# EasyEDA Pro project ProDoc_Relay_2025-09-14.epro, board PCB5
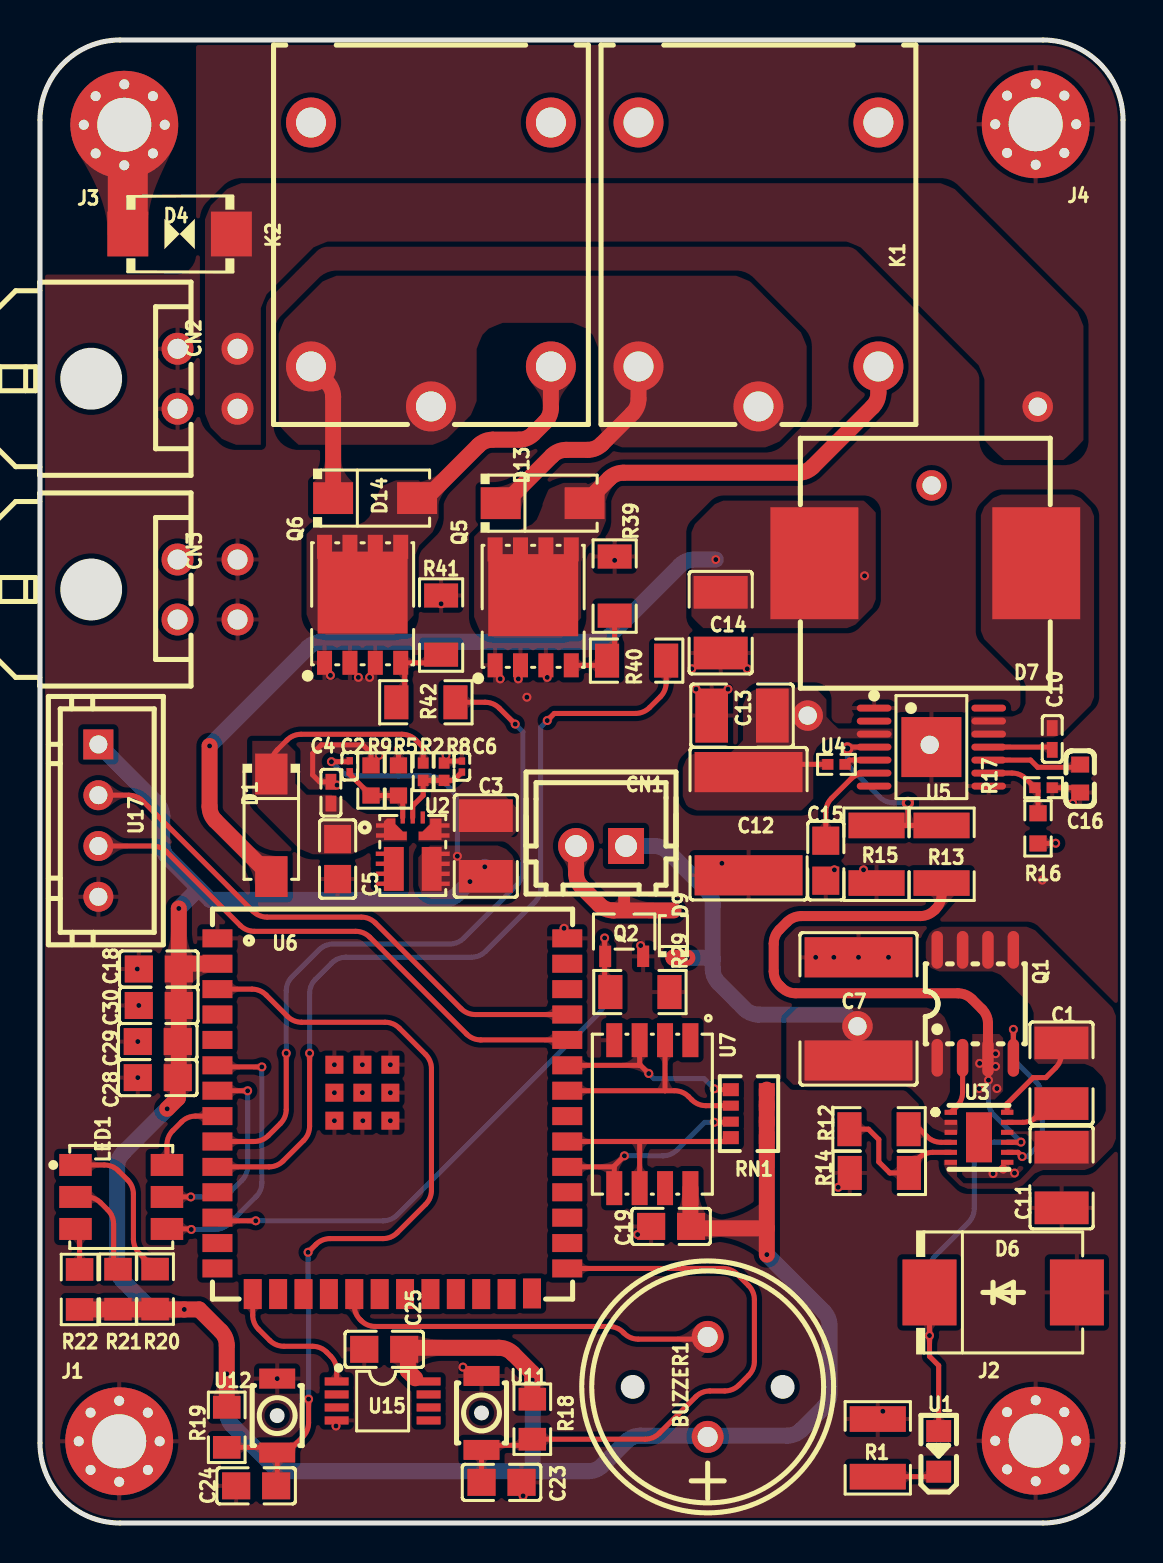
[diagram p1: board, top side]
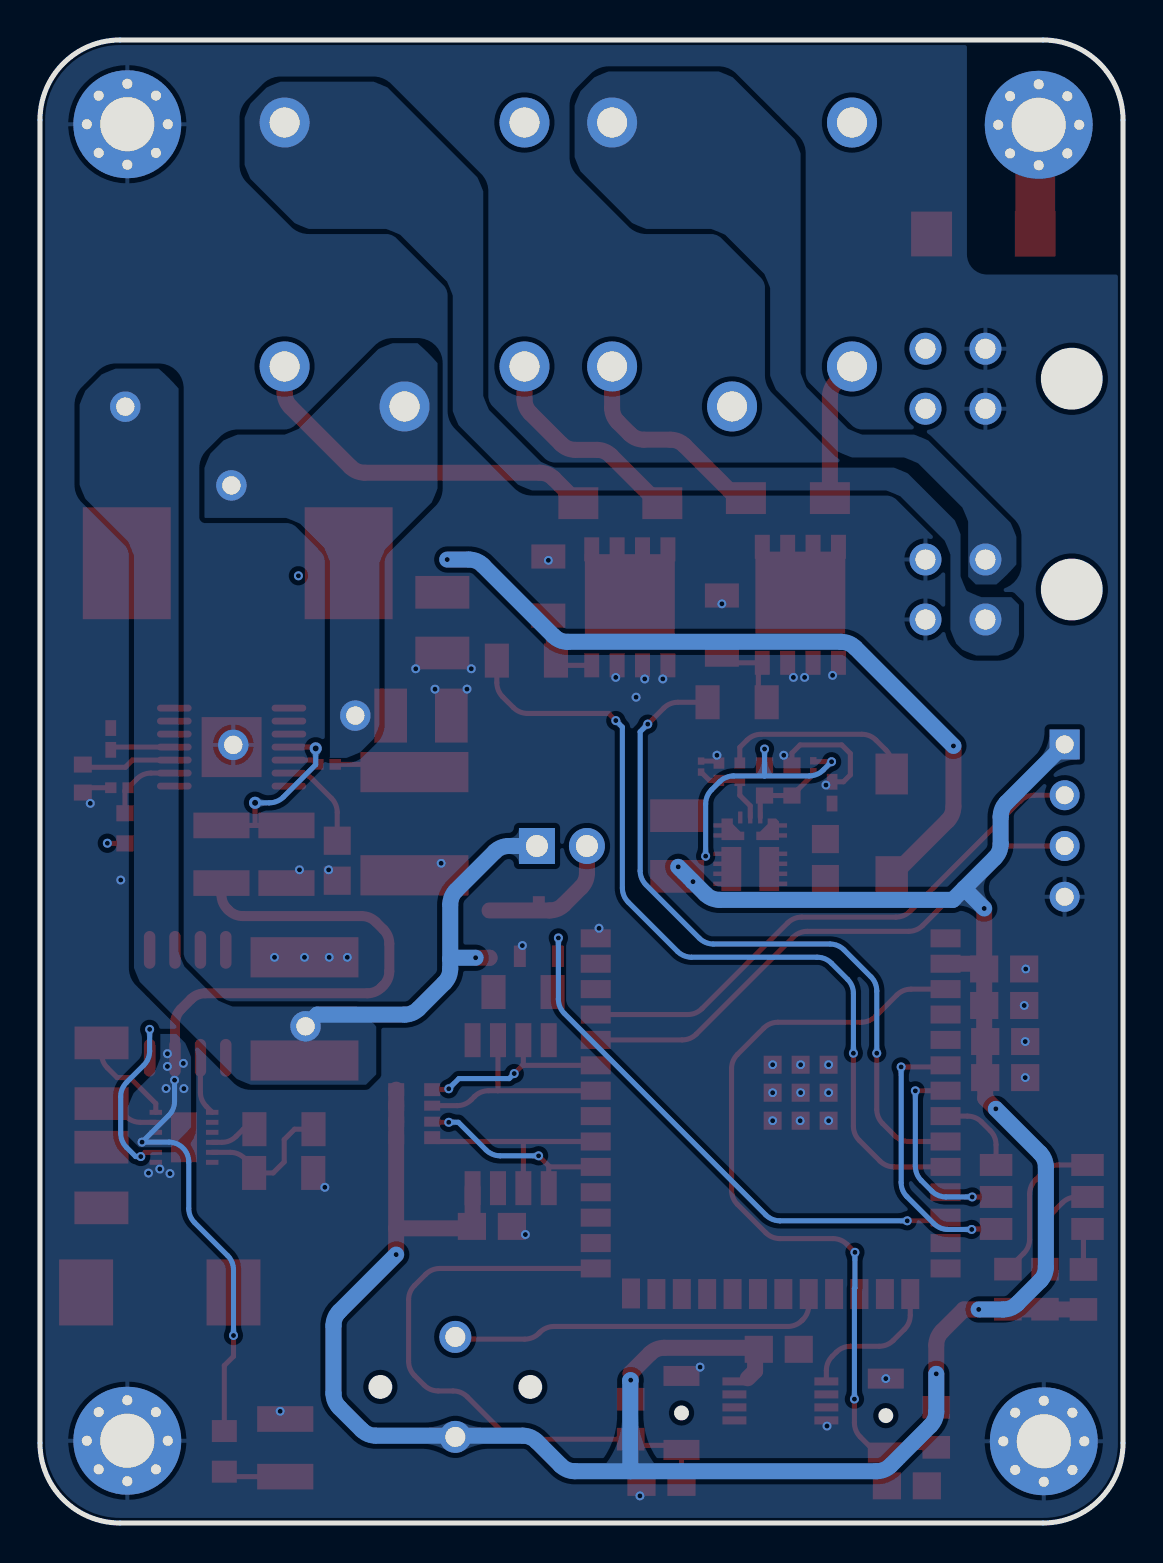
[diagram p2: board, bottom side, seen from below]

Outline 54.18 x 74.17 mm; copper layers: Top Layer, Inner1, Inner2, Bottom Layer. Coordinates in mm from the lower left corner of the outline.
Outline path: 0,70.17 0,4 arc(1.17,1.17) 4,0 50.18,0 arc(53.01,1.17) 54.18,4 54.18,70.17 arc(53.01,73) 50.18,74.17 4,74.17 arc(1.17,73) 0,70.17
Stack: Top Layer 0.035mm / Dielectric1 1.51mm FR4 er 4.5 / Inner1 0.035mm / Dielectric2 0.48mm PP er 4.5 / Inner2 0.035mm / Dielectric3 0.48mm PP er 4.5 / Bottom Layer 0.035mm

## Design rules (mm)
template: Custom Config
spacing copperThickness1oz (default): track to track 0.102, other pairs 0.152 to 0.3
spacing copperThickness2oz: track to track 0.203, other pairs 0.152 to 0.3
track width copperThickness1oz (default): min 0.127, default 0.254, max 2.54
track width copperThickness2oz: min 0.203, default 0.254, max 100
differential pair differentialPair (default): width min 0.127, default 0.254, max 2.54; gap min 0.152, default 0.152
via viaSize (default): diameter min 0.45, default 0.45, max 10; hole min 0.25, default 0.25, max 6.3

## Placement (name value [footprint] x y rotation side)
BUZZER1  4kHz  [BUZ-TH_PKM13EPYH4002-B0]  33.4 6.81 90 top
C1  100nF  [C1210]  51.1 22.49 270 top
C2  22pF  [C0201]  15.49 37.85 90 top
C3  47uF  [C1210]  22.3 33.86 270 top
C4  100nF  [C0402]  14.55 36.52 270 top
C5  10uF  [C0805]  14.89 33.21 90 top
C6  10nF  [C0201]  21.11 37.83 270 top
C7  1uF  [C2220]  40.95 25.71 90 top
C10  10nF  [C0402]  50.64 39.21 270 top
C11  100nF  [C1210]  51.11 17.28 90 top
C12  1uF  [C2220]  35.45 34.97 90 top
C13  100nF  [C1210]  35.12 40.38 0 top
C14  100uF  [C1210]  34.05 45.03 90 top
C15  22nF  [C0805]  39.31 33.12 90 top
C16  1uF  [C0603]  52.03 37.23 90 top
C18  100nF  [C0805]  5.94 27.71 0 top
C19  100nF  [C0805]  31.57 14.83 0 top
C23  100nF  [C0805]  23.09 2.03 0 top
C24  100nF  [C0805]  10.81 1.86 180 top
C25  100nF  [C0805]  17.22 8.69 0 top
C28  100nF  [C0805]  5.89 22.28 0 top
C29  100nF  [C0805]  5.89 24.08 0 top
C30  100nF  [C0805]  5.94 25.88 0 top
CN1  ZX-XH2.54-2PZZ  [CONN-TH_2P-P2.50_HX25003-2A]  28.07 33.86 180 top
CN2  430450400  [CONN-TH_0430450400]  8.38 57.23 270 top
CN3  430450400  [CONN-TH_0430450400]  8.38 46.69 270 top
D1  US1M  [SMA_L4.4-W2.8-LS5.4-RD]  11.57 34.89 270 top
D4  SMBJ58CA  [SMB_L4.6-W3.6-LS5.3-BI]  6.98 64.47 0 top
D6  SMCJ58A  [SMC_L6.9-W5.8-LS7.9-RD]  48.18 11.53 0 top
D7  68uH  [IND-SMD_L12.5-W12.5-SRR1280-150M]  44.29 48 180 top
D9  BAT46WJ,115  [SOD-323F_L2.0-W1.6-LS2.5-RD]  31.69 29.45 90 top
D13  1N4007  [SMA_L4.3-W2.5-LS5.0-RD]  25.15 51 0 top
D14  1N4007  [SMA_L4.3-W2.5-LS5.0-RD]  16.76 51.26 0 top
J1  SCREW-MOUNTING-HOLE-3MM  [MountingHole:MountingHole_2.7mm_M2.5_Pad_Via]  3.96 4.09 0 top
J2  SCREW-MOUNTING-HOLE-3MM  [MountingHole:MountingHole_2.7mm_M2.5_Pad_Via]  49.81 4.11 0 top
J3  SCREW-MOUNTING-HOLE-3MM  [MountingHole:MountingHole_2.7mm_M2.5_Pad_Via]  4.22 69.93 0 top
J4  SCREW-MOUNTING-HOLE-3MM  [MountingHole:MountingHole_2.7mm_M2.5_Pad_Via]  49.81 69.95 0 top
K1  SRD-48VDC-SL-C  [RELAY-TH_SRD-48VDC-SL-C]  35.94 62.94 90 top
K2  SRD-48VDC-SL-C  [RELAY-TH_SRD-48VDC-SL-C]  19.56 62.94 90 top
LED1  HL-AF-5060H271BU46FU79GC-S1-THL  [LED-ARRAY-SMD_6P-L5.4-W5.0-TL-FD]  4.06 16.31 0 top
NOREF  -  [Pad_e4917]  40.89 24.84 0 top
NOREF#2  -  [Pad_e5382]  44.6 51.89 0 top
NOREF#3  -  [Pad_e4911]  38.4 40.38 0 top
NOREF#4  -  [Pad_e4414]  44.51 38.92 0 top
NOREF#5  -  [Pad_e4914]  49.91 55.83 0 top
Q1  FDS3992  [SO-8_L4.9-W3.9-P1.27-LS5.9-BL]  46.79 25.97 0 top
Q2  AO3400A  [SOT-23-3_L2.9-W1.6-P1.90-LS2.8-BR]  29.22 29.58 270 top
Q5  SI7456  [POWERPAK-SO-8_L5.9-W4.9-P1.27-LS6.2-BL]  24.67 45.79 0 top
Q6  SI7456  [POWERPAK-SO-8_L5.9-W4.9-P1.27-LS6.2-BL]  16.14 45.92 0 top
R1  22kΩ  [R1210]  41.91 3.76 270 top
R2  22.1kΩ  [R0402]  19.17 37.57 90 top
R5  135kΩ  [R0603]  17.93 37.13 90 top
R8  10kΩ  [R0402]  20.22 37.57 270 top
R9  30kΩ  [R0603]  16.56 37.13 270 top
R12  105kΩ  [R1206]  41.97 19.69 0 top
R13  75kΩ  [R1210]  45.1 33.45 270 top
R14  2.21kΩ  [R1206]  41.99 17.51 0 top
R15  2.8kΩ  [R1210]  41.85 33.45 90 top
R16  3kΩ  [R0603]  49.93 34.74 270 top
R17  2kΩ  [R0402]  50.2 36.77 180 top
R18  10kΩ  [R0805]  24.63 5.19 270 top
R19  10kΩ  [R0805]  9.34 4.78 270 top
R20  300Ω  [R0805]  1.98 11.68 270 top
R21  300Ω  [R0805]  3.9 11.69 270 top
R22  300Ω  [R0805]  5.76 11.7 270 top
R29  68kΩ  [R1206]  30.01 26.55 0 top
R39  10MΩ  [R1206]  28.75 46.86 270 top
R40  10kΩ  [R1206]  29.84 43.13 0 top
R41  10MΩ  [R1206]  20.07 44.91 270 top
R42  10kΩ  [R1206]  19.3 41.05 0 top
RN1  10kΩ  [RES-ARRAY-SMD_0603-8P-L3.2-W1.6-BL]  35.46 20.47 270 top
U1  APT2012LZGCK  [LED-SMD_L2.0-W1.3-R-RD]  44.96 3.58 90 top
U2  TPSM863252RDXR  [QFN-7_L4.0-W3.3_TPSM863257RDXR]  18.65 34 0 top
U3  LM74800QDRRRQ1  [WSON-12_L3.0-W3.0-P0.50-TL-EP-2]  46.97 19.29 0 top
U4  261kΩ  [R0402]  39.84 37.94 180 top
U5  LM5161PWPR  [HTSSOP-14_L5.0-W4.4-P0.65-LS6.4-BL-EP3.0]  44.59 38.8 270 top
U6  ESP32-S3-WROOM-1U-N8R8  [WIRELM-SMD_ESP32-S3-WROOM-1U]  17.63 20.34 0 top
U7  MKDV8GIL-AST  [LGA-8_L6.0-W8.0-P1.27-TL]  30.63 20.45 270 top
U11  TD-1183SN-1.7H-250  [KEY-SMD_L3.0-W2.5-LS4.0]  22.09 5.5 90 top
U12  TD-1183SN-1.7H-250  [KEY-SMD_L3.0-W2.5-LS4.0]  11.87 5.37 90 top
U15  DS18B20U-MS  [MSOP-8_L3.0-W3.0-P0.65-LS4.9-BL-1]  17.14 6.11 270 top
U17  ZX-XH2.54-4PZZ-Y  [CONN-TH_4P-P2.50_ZX-XH2.54-4PZZ-Y]  2.92 35.13 90 top

## Footprints (pads in the part's own frame, mm; a bottom-side part is the same pattern mirrored in y, then rotated)
BUZ-TH_PKM13EPYH4002-B0
  round 1.6 hole 1: 1(-2.5,0) 2(2.5,0)
C0201
  rect 0.368x0.324 smd: 1(-0.275,0) 2(0.275,0)
C0402
  rect 0.79x0.54 smd: 1(-0.545,0) 2(0.545,0)
C0603
  rect 0.8x0.9 smd: 1(-0.7,0) 2(0.7,0)
C0805
  rect 1.41x1.35 smd: 1(-1,0) 2(1,0)
C1210
  rect 1.635x2.7 smd: 1(-1.518,0) 2(1.518,0)
C2220
  rect 2.01x5.4 smd: 1(-2.58,0) 2(2.58,0)
CONN-TH_2P-P2.50_HX25003-2A
  rect 1.8x1.8 hole 1.1: 1(-1.25,0)
  round 1.8 hole 1.1: 2(1.25,0)
CONN-TH_4P-P2.50_ZX-XH2.54-4PZZ-Y
  rect 1.5x1.5 hole 0.9: 1(3.81,0)
  round 1.5 hole 0.9: 2(1.27,0) 3(-1.27,0) 4(-3.81,0)
CONN-TH_0430450400
  round 1.6 hole 1: 1(1.5,-1.5) 2(-1.5,-1.5) 3(1.5,1.5) 4(-1.5,1.5)
HTSSOP-14_L5.0-W4.4-P0.65-LS6.4-BL-EP3.0
  oval 0.343x1.732 smd: 1(-1.95,-2.866) 2(-1.3,-2.866) 3(-0.65,-2.866) 4(0,-2.866) 5(0.65,-2.866) 6(1.3,-2.866) 7(1.95,-2.866) 8(1.95,2.866) 9(1.3,2.866) 10(0.65,2.866) 11(0,2.866) 12(-0.65,2.866) 13(-1.3,2.866) 14(-1.95,2.866)
  rect 3x3 smd: 15(0,0)
IND-SMD_L12.5-W12.5-SRR1280-150M
  rect 4.4x5.6 smd: 1(-5.55,0) 2(5.55,0)
KEY-SMD_L3.0-W2.5-LS4.0
  rect 1x1.8 smd: 1(-1.85,0) 2(1.85,0)
LED-ARRAY-SMD_6P-L5.4-W5.0-TL-FD
  rect 1.625x1.1 smd: 1(-2.288,1.6) 2(-2.288,0) 3(-2.288,-1.6) 4(2.288,-1.6) 5(2.288,0) 6(2.288,1.6)
LED-SMD_L2.0-W1.3-R-RD
  rect 1.1x1.25 smd: 1(1.016,0) 2(-1.016,0)
LGA-8_L6.0-W8.0-P1.27-TL
  rect 1.7x0.8 smd: 1(-3.7,1.905) 2(-3.7,0.635) 3(-3.7,-0.635) 4(-3.7,-1.905) 5(3.7,-1.905) 6(3.7,-0.635) 7(3.7,0.635) 8(3.7,1.905)
MountingHole:MountingHole_2.7mm_M2.5_Pad_Via
  round 0.8 hole 0.5: 1(-2.025,0) 1(-1.432,1.432) 1(-1.432,-1.432) 1(0,2.025) 1(0,-2.025) 1(1.432,1.432) 1(1.432,-1.432) 1(2.025,0)
  round 5.4 hole 2.7: 1(0,0)
MSOP-8_L3.0-W3.0-P0.65-LS4.9-BL-1
  rect 0.406x1.2 smd: 1(-0.975,-2.3) 2(-0.325,-2.3) 3(0.325,-2.3) 4(0.975,-2.3) 5(0.975,2.3) 6(0.325,2.3) 7(-0.325,2.3) 8(-0.975,2.3)
Pad_e4414
  round 1.524 hole 0.914: 1(0,0)
Pad_e4911
  round 1.524 hole 0.914: 1(0,0)
Pad_e4914
  round 1.524 hole 0.914: 1(0,0)
Pad_e4917
  round 1.524 hole 0.914: 1(0,0)
Pad_e5382
  round 1.524 hole 0.914: 1(0,0)
POWERPAK-SO-8_L5.9-W4.9-P1.27-LS6.2-BL
  rect 0.75x1.2 smd: 1(-1.905,-2.9) 2(-0.635,-2.9) 3(0.635,-2.9) 4(1.905,-2.9) 5(1.905,2.9) 6(0.635,2.9) 7(-0.635,2.9) 8(-1.905,2.9)
  rect 4.5x4.1 smd: 8(0,0.609)
QFN-7_L4.0-W3.3_TPSM863257RDXR
  custom 1.54x1.08 smd: 1(-0.975,0.697) 4(0.975,0.697)
  custom 1.4x2.195 smd: 2(-1.05,-1.286) 3(1.05,-1.286)
  rect 0.22x0.6 smd: 5(0.5,1.286) 6(0,1.286) 7(-0.5,1.286)
R0402
  rect 0.566x0.54 smd: 1(-0.433,0) 2(0.433,0)
R0603
  rect 0.806x0.864 smd: 1(-0.753,0) 2(0.753,0)
R0805
  rect 1.133x1.377 smd: 1(-1,0) 2(1,0)
R1206
  rect 1.208x1.701 smd: 1(-1.479,0) 2(1.479,0)
R1210
  rect 1.282x2.808 smd: 1(-1.441,0) 2(1.441,0)
RELAY-TH_SRD-48VDC-SL-C
  round 2.5 hole 1.5: 1(-5.1,-6) 2(-7.1,0) 3(7.1,-6) 4(7.1,6) 5(-5.1,6)
RES-ARRAY-SMD_0603-8P-L3.2-W1.6-BL
  rect 0.65x0.8 smd: 1(-1.2,-0.9) 4(1.2,-0.9) 5(1.2,0.9) 8(-1.2,0.9)
  rect 0.5x0.8 smd: 2(-0.4,-0.9) 3(0.4,-0.9) 6(0.4,0.9) 7(-0.4,0.9)
SMA_L4.3-W2.5-LS5.0-RD
  rect 2x1.593 smd: 1(-2.1,0) 2(2.1,0)
SMA_L4.4-W2.8-LS5.4-RD
  rect 2.046x1.62 smd: 1(-2.566,0) 2(2.566,0)
SMB_L4.6-W3.6-LS5.3-BI
  rect 2.047x2.241 smd: 1(-2.591,0) 2(2.591,0)
SMC_L6.9-W5.8-LS7.9-RD
  rect 2.7x3.3 smd: 1(-3.687,0) 2(3.687,0)
SO-8_L4.9-W3.9-P1.27-LS5.9-BL
  oval 0.574x1.888 smd: 1(-1.905,-2.699) 2(-0.635,-2.699) 3(0.635,-2.699) 4(1.905,-2.699) 5(1.905,2.699) 6(0.635,2.699) 7(-0.635,2.699) 8(-1.905,2.699)
SOD-323F_L2.0-W1.6-LS2.5-RD
  rect 0.73x0.385 smd: 1(-1.185,0) 2(1.185,0)
SOT-23-3_L2.9-W1.6-P1.90-LS2.8-BR
  rect 1.07x0.6 smd: 1(1.235,-0.95) 2(1.235,0.95) 3(-1.235,0)
WIRELM-SMD_ESP32-S3-WROOM-1U
  rect 1.5x0.9 smd: 1(-8.75,8.895) 2(-8.75,7.625) 3(-8.75,6.355) 4(-8.75,5.085) 5(-8.75,3.815) 6(-8.75,2.545) 7(-8.75,1.275) 8(-8.75,0.005) 9(-8.75,-1.265) 10(-8.75,-2.535) 11(-8.75,-3.805) 12(-8.75,-5.075) 13(-8.75,-6.345) 14(-8.75,-7.615) 27(8.75,-7.615) 28(8.75,-6.345) 29(8.75,-5.075) 30(8.75,-3.805) 31(8.75,-2.535) 32(8.75,-1.265) 33(8.75,0.005) 34(8.75,1.275) 35(8.75,2.545) 36(8.75,3.815) 37(8.75,5.085) 38(8.75,6.355) 39(8.75,7.625) 40(8.75,8.895)
  rect 0.9x1.5 smd: 15(-6.985,-8.895) 16(-5.715,-8.895) 17(-4.445,-8.895) 18(-3.175,-8.895) 19(-1.905,-8.895) 20(-0.635,-8.895) 21(0.635,-8.895) 22(1.905,-8.895) 23(3.175,-8.895) 24(4.445,-8.895) 25(5.715,-8.895) 26(6.985,-8.865)
  rect 0.9x0.9 smd: 41(-2.9,2.575) 41(-2.9,1.175) 41(-2.9,-0.225) 41(-1.5,2.575) 41(-1.5,1.175) 41(-1.5,-0.225) 41(-0.1,2.575) 41(-0.1,1.175) 41(-0.1,-0.225)
WSON-12_L3.0-W3.0-P0.50-TL-EP-2
  rect 0.623x0.25 smd: 1(-1.411,1.25) 2(-1.411,0.75) 3(-1.411,0.25) 4(-1.411,-0.25) 5(-1.411,-0.75) 6(-1.411,-1.25) 7(1.411,-1.25) 8(1.411,-0.75) 9(1.411,-0.25) 10(1.411,0.25) 11(1.411,0.75) 12(1.411,1.25)
  rect 1.3x2.5 smd: 13(0,0)

## Nets
As in the schematic, except:
+48V: C12.2 C13.2 D6.1 D13.1 D14.1 K1.2 K1.5 K2.2 K2.5 NOREF#2.1 NOREF#3.1 Q1.3 R13.2 U1.1 U3.9 U4.2 U5.3
GND: C3.1 C4.1 C5.1 C6.1 C7.2 C11.1 C12.1 C13.1 C14.1 C15.1 C16.1 C18.1 C19.1 C23.2 C24.2 C25.1 C28.1 C29.1 C30.1 CN2.1 CN2.2 CN3.3 CN3.4 D6.2 J1.1 J2.1 J4.1 NOREF#4.1 Q2.2 Q5.1 Q5.2 Q5.3 Q6.1 Q6.2 Q6.3 R1.1 R8.1 R9.1 R14.1 R15.1 R17.1 R29.2 R39.1 R41.1 U2.4 U3.7 U5.1 U5.2 U5.8 U5.15 U6.1 U6.40 U6.41 U7.4 U11.2 U12.2 U15.4 U17.4
VIN: C7.1 CN1.1 CN2.3 CN2.4 D4.2 D9.1 NOREF.1 NOREF#5.1 Q1.1 U3.2 U3.3

Pads without a net: K1 4; K2 4; U2 2 5; U3 13; U5 7 14; U6 11 13 14 16 17 18 20 21 22 23 24 25 26 28 29 30 33 38 39; U15 2 3 5 6 7

## Via types
v1: diameter 0.45, hole 0.25, Top Layer to Bottom Layer, 92 vias
v2: diameter 0.61, hole 0.305, Top Layer to Bottom Layer, 2 vias

## Routing (per net, layer and track width the routed paths; a pad name or vN(x,y) marks a point on that pad's centre or on a via; arc(x,y) is an arc through that point)
+3V3: length 147.2
  Top Layer w0.254: R5.2 v1(17.93,38.71) ; v1(14.58,38.07) 15.45,38.07 C2.2
  Top Layer w0.8: 36.36,14.74 v1(36.36,13.42) ; 36.36,14.74 32.71,14.74 32.54,14.91 U7.8 ; 36.36,14.74 36.36,19.39 ; R20.2 v1(7.22,10.68) 7.96,10.68 9.05,9.59 arc(9.27,9.27) 9.34,8.89 v1(9.34,7.46) R19.1 ; U6.2 7.21,27.97 C18.2 ; v1(6.36,20.71) 6.89,21.24 C28.2 6.94,22.33 C18.2 ; C18.2 v1(6.94,30.73) ; RN1.8 RN1.7 RN1.6 36.36,19.66 ; 18.77,7.24 18.4,7.6 18.4,8.76 22.95,8.76 arc(23.34,8.69) 23.66,8.47 24.63,7.5 v1(24.63,7.15) R18.1
  Bottom Layer w0.254: 17.93,37.36 19.47,37.36 arc(19.86,37.29) 20.18,37.07 20.59,36.67 arc(20.8,36.34) 20.88,35.96 v1(20.88,33.35) ; 17.93,37.36 15.7,37.36 arc(15.32,37.44) 15,37.66 v1(14.58,38.07) ; 17.93,37.36 v1(17.93,38.71)
  Bottom Layer w0.8: v1(24.63,7.15) 24.65,7.12 24.65,2.59 ; 24.65,2.59 12.33,2.59 arc(11.94,2.67) 11.62,2.88 9.64,4.87 arc(9.42,5.19) 9.34,5.57 v1(9.34,7.46) ; 24.65,2.59 27.42,2.59 arc(27.81,2.67) 28.13,2.88 29.32,4.08 arc(29.65,4.29) 30.03,4.37 33.34,4.37 ; v1(36.36,13.42) 39.2,10.58 arc(39.42,10.26) 39.5,9.87 39.5,6.48 arc(39.42,6.1) 39.2,5.78 38.09,4.66 arc(37.76,4.44) 37.38,4.37 33.34,4.37 ; v1(6.94,30.73) 7.94,31.73 ; 7.94,31.73 8.51,31.17 20.19,31.17 arc(20.57,31.24) 20.89,31.46 v1(21.51,32.08) v1(22.25,32.82) ; 7.94,31.73 6.41,33.26 arc(6.2,33.58) 6.12,33.97 6.12,35.32 arc(6.05,35.71) 5.83,36.03 U17.1 ; 33.34,4.37 BUZZER1.1 ; v1(6.36,20.71) 4.15,18.5 arc(3.94,18.18) 3.86,17.8 3.86,12.81 arc(3.94,12.43) 4.15,12.1 5.28,10.97 arc(5.61,10.76) 5.99,10.68 v1(7.22,10.68)
+5V: length 57
  Top Layer w0.254: R16.2 50.8,33.99 v1(50.81,34)
  Top Layer w0.8: D1.2 8.78,35.12 arc(8.56,35.45) 8.48,35.83 v1(8.48,38.86)
  Inner2 w0.254: v1(41.25,47.37) 44.29,47.37 arc(44.67,47.29) 45,47.08 50.51,41.56 arc(50.73,41.24) 50.81,40.85 v1(50.81,34)
  Bottom Layer w0.8: v1(8.48,38.86) 13.4,43.78 arc(13.72,43.99) 14.1,44.07 27.78,44.07 arc(28.16,44.15) 28.49,44.36 32.02,47.89 arc(32.34,48.11) 32.72,48.18 v1(33.81,48.18)
+48V: length 72.5
  Top Layer w0.254: U3.9 49.06,19.04 v1(49.07,19.05) ; v1(47.45,22.15) 47.45,23.24 Q1.3 ; C12.2 35.84,37.94 U4.2 ; D6.1 v1(44.5,9.38) 44.5,8.33 44.96,7.88 U1.1
  Top Layer w0.5: R13.2 45.1,31.42 arc(45.02,31.03) 44.81,30.71 44.74,30.65 arc(44.42,30.43) 44.04,30.35 38.08,30.35 arc(37.7,30.28) 37.38,30.06 37,29.68 arc(36.78,29.36) 36.7,28.97 36.7,27.59 arc(36.78,27.21) 37,26.88 37.1,26.78 arc(37.42,26.57) 37.8,26.49 45.92,26.49 arc(46.3,26.42) 46.62,26.2 47.13,25.69 arc(47.35,25.37) 47.42,24.98 Q1.3
  Top Layer w0.8: K1.5 29.94,56.21 arc(29.86,55.83) 29.65,55.5 28.11,53.96 arc(27.78,53.75) 27.4,53.67 26.32,53.67 arc(25.94,53.59) 25.62,53.38 23.24,51 D13.1 ; D14.1 14.66,56.32 arc(14.59,56.7) 14.37,57.03 K2.5
  Bottom Layer w0.254: v1(44.5,9.38) 44.5,12.66 arc(44.57,13.05) 44.79,13.37 46.44,15.02 arc(46.66,15.35) 46.74,15.73 46.74,18.05 arc(47.03,18.76) 47.74,19.05 v1(49.07,19.05) 47.74,20.38 arc(47.52,20.71) 47.45,21.09 v1(47.45,22.15)
  vias: v1(47.01,22.99) v1(46.98,21.73) v1(47.8,23.47) v1(47.8,22.83) v1(47.87,21.73)
GND: length 8.4
  Top Layer w0.254: R8.1 20.31,38.11 C6.1 ; C16.1 51.79,36.77 R17.1 ; C4.1 13.98,37.07 13.64,37.41 13.64,38.48 14.07,38.91 16.15,38.91 16.56,38.51 R9.1
  vias: v1(4.87,27.71) v1(4.89,24.08) v1(4.89,22.28) v1(4.94,25.88) v1(11.87,7.22) v1(14.53,42.39) v1(14.73,22.92) v1(14.73,21.52) v1(14.73,20.12) v1(14.81,4.85) v1(14.86,36.91) v1(15.93,42.29) v1(16.13,22.92) v1(16.13,21.52) v1(16.15,20.12) v1(16.49,42.29) v1(16.97,38.4) v1(17.53,22.92) v1(17.53,21.52) v1(17.53,20.12) v1(20.07,45.97) v1(20.31,38.4) v1(21.16,7.8) v1(23.02,42.21) v1(23.93,42.21) v1(24.17,1.36) v1(24.36,41.3) v1(25.37,42.29) v1(26.21,29.74) v1(28.75,48.15) v1(29.9,14.43) v1(30.05,28.88) v1(32.6,42.72) v1(32.82,41.71) v1(34.11,32.99) v1(34.42,41.7) v1(35.38,42.72) v1(38.8,28.29) v1(39.71,28.29) v1(39.74,32.67) v1(39.93,16.79) v1(40.95,28.29) v1(41.2,32.67) v1(42.16,5.59) v1(42.45,28.29) v1(47.68,17.47) v1(48.18,17.7) v1(48.75,17.5) v1(50.14,32.16) v1(51.66,35.99)
VCC: length 9.9
  Top Layer w0.254: R2.2 19.17,38.79 18.81,39.15 arc(18.49,39.37) 18.1,39.45 13.06,39.45 arc(12.68,39.37) 12.36,39.15 11.87,38.66 arc(11.65,38.34) 11.57,37.95 D1.1
VIN: length 19.5
  Top Layer w0.8: v1(32.38,28.27) 31.69,28.27 D9.1
  Bottom Layer w0.8: 33.66,28.21 33.59,28.27 v1(32.38,28.27) ; 33.66,28.21 33.66,27.72 arc(33.73,27.34) 33.95,27.01 35.24,25.72 arc(35.57,25.5) 35.95,25.42 40.31,25.42 NOREF.1 ; 33.66,28.21 33.66,30.93 arc(33.58,31.31) 33.36,31.64 31.43,33.56 arc(31.11,33.78) 30.73,33.86 CN1.1
B: length 4.3
  Top Layer w0.254: U6.8 7.78,20.35 arc(7.4,20.27) 7.08,20.06 6.64,19.62 arc(6.43,19.3) 6.35,18.92 LED1.6
BOOT: length 30.4
  Top Layer w0.254: 22.09,2.03 U11.1 22.32,3.89 24.32,3.89 R18.2 30.27,4.19 arc(30.65,4.27) 30.98,4.48 32.8,6.31 arc(33.13,6.53) 33.51,6.6 34.26,6.6 arc(34.64,6.68) 34.96,6.9 35.44,7.38 arc(35.66,7.7) 35.74,8.09 35.74,11.17 arc(35.66,11.55) 35.44,11.88 34.88,12.44 arc(34.56,12.65) 34.18,12.73 U6.27
BRESS: length 7.8
  Top Layer w0.254: LED1.1 3.22,17.91 arc(3.6,17.83) 3.93,17.61 4.38,17.16 arc(4.6,16.83) 4.67,16.45 4.67,14.19 arc(4.75,13.81) 4.97,13.49 R22.1
BST: length 3.2
  Top Layer w0.254: U5.11 50.5,38.8 C10.2
BUZZ: length 19.1
  Top Layer w0.254: U6.19 15.72,10.88 arc(15.8,10.5) 16.02,10.17 16.06,10.12 arc(16.39,9.91) 16.77,9.83 28.47,9.83 arc(28.85,9.75) 29.17,9.54 29.22,9.49 arc(29.55,9.27) 29.93,9.19 33.29,9.19 BUZZER1.2
CAP: length 3.1
  Top Layer w0.254: U3.11 49.16,20.04 arc(49.55,20.11) 49.87,20.33 50.51,20.97 C1.2
DGATE: length 2.9
  Top Layer w0.254: U3.1 45.86,20.84 arc(46.08,21.16) 46.15,21.54 Q1.2
EARTH: length 5.5
  Top Layer w2: J3.1 4.39,69.75 D4.1
EN: length 41.3
  Top Layer w0.254: v1(13.44,6.2) 13.44,5.01 arc(13.36,4.63) 13.14,4.3 12.36,3.52 U12.1 ; U12.1 11.6,3.78 R19.2 ; U12.1 11.87,1.91 C24.1 ; U6.3 10.6,26.7 arc(10.99,26.62) 11.31,26.41 12.38,25.34 arc(12.71,25.12) 13.09,25.04 17.26,25.04 arc(17.65,24.97) 17.97,24.75 19.29,23.43 arc(19.51,23.11) 19.58,22.72 19.58,16.64 arc(19.51,16.26) 19.29,15.94 17.87,14.52 arc(17.55,14.3) 17.16,14.22 14.51,14.22 arc(14.13,14.15) 13.8,13.93 v1(13.41,13.54)
  Bottom Layer w0.254: v1(13.44,6.2) 13.44,11.73 13.41,11.76 v1(13.41,13.54)
END: length 4.2
  Top Layer w0.254: U2.6 18.65,35.87 19.17,36.39 R2.1 R8.2 20.69,37.14 C6.2
FAN: length 30.1
  Top Layer w0.254: U6.12 9.03,15.11 v1(10.79,15.11) ; R29.1 28.25,26.84 v1(28.25,29.26)
  Bottom Layer w0.254: v1(10.79,15.11) 17.16,15.11 arc(17.55,15.19) 17.87,15.41 27.95,25.49 arc(28.17,25.81) 28.25,26.19 v1(28.25,29.26)
FB3: length 4.1
  Top Layer w0.254: C2.1 15.49,37.45 16.27,36.67 arc(16.59,36.46) 16.97,36.38 R5.1 18.15,36.17 U2.7
FB5: length 3.9
  Top Layer w0.254: R16.1 49.93,36.62 R17.2 49.33,37.21 arc(49.01,37.43) 48.62,37.5 U5.9
FNMSS: length 7.2
  Top Layer w0.8: CN1.2 26.82,32.5 arc(26.89,32.12) 27.11,31.79 27.97,30.93 arc(28.3,30.71) 28.68,30.63 D9.2
G: length 10.1
  Top Layer w0.254: LED1.5 v1(7.54,16.31) ; U6.7 10.38,21.62 v1(10.39,21.61)
  Bottom Layer w0.254: v1(7.54,16.31) 8.86,16.31 arc(9.24,16.38) 9.56,16.6 10.1,17.13 arc(10.31,17.46) 10.39,17.84 v1(10.39,21.61)
GRESS: length 5
  Top Layer w0.254: R21.1 3.68,12.91 3.68,14.95 arc(3.61,15.34) 3.39,15.66 3.04,16.01 arc(2.71,16.23) 2.33,16.31 LED1.2
HGATE: length 9.7
  Top Layer w0.254: Q1.4 v1(48.69,24.69) ; v1(49.14,18.33) 48.92,18.54 U3.8
  Bottom Layer w0.254: v1(48.69,24.69) 48.69,23.6 arc(48.77,23.22) 48.99,22.9 49.85,22.03 arc(50.06,21.71) 50.14,21.33 50.14,19.49 arc(50.06,19.11) 49.85,18.78 49.39,18.33 v1(49.14,18.33)
LED: length 3.1
  Top Layer w0.254: R1.2 44.71,2.32 U1.2
LEFT_LED: length 42.8
  Top Layer w0.254: R40.2 31.32,42.02 arc(31.25,41.64) 31.03,41.32 30.49,40.78 arc(30.17,40.56) 29.79,40.49 25.73,40.49 v1(25.37,40.13) ; U6.10 11.45,17.81 arc(11.84,17.89) 12.16,18.1 13.19,19.14 arc(13.41,19.46) 13.49,19.84 v1(13.49,23.49)
  Bottom Layer w0.254: v1(25.37,40.13) 25.04,39.8 25.04,31.76 arc(24.97,31.37) 24.75,31.05 22.29,28.59 arc(21.96,28.37) 21.58,28.3 15.3,28.3 arc(14.92,28.22) 14.59,28 13.78,27.19 arc(13.56,26.87) 13.49,26.48 v1(13.49,23.49)
OV: length 7.2
  Top Layer w0.254: R12.1 41.44,19.69 41.96,19.18 41.96,18.06 42.51,17.51 R14.2 43.47,17.76 43.95,18.24 arc(44.27,18.46) 44.66,18.54 U3.5
R: length 13.9
  Top Layer w0.254: v1(11.1,22.81) 8.96,22.81 U6.6 ; LED1.4 7.54,14.71 v1(7.57,14.68)
  Bottom Layer w0.254: v1(11.1,22.81) 11.1,17.03 arc(11.02,16.64) 10.81,16.32 9.46,14.97 arc(9.14,14.76) 8.75,14.68 v1(7.57,14.68)
RIGHT_LED: length 35.7
  Top Layer w0.254: U6.9 10.72,19.08 arc(11.1,19.16) 11.42,19.37 12.03,19.98 arc(12.24,20.3) 12.32,20.68 v1(12.32,23.49) ; 20.78,41.05 22.27,41.05 arc(22.65,40.97) 22.97,40.75 v1(23.77,39.95)
  Bottom Layer w0.254: v1(23.77,39.95) 24.16,39.57 24.16,32.62 arc(24.08,32.24) 23.86,31.91 21.2,29.25 arc(20.87,29.03) 20.49,28.96 14.66,28.96 arc(14.28,28.88) 13.96,28.66 12.61,27.32 arc(12.4,26.99) 12.32,26.61 v1(12.32,23.49)
RLM: length 18.4
  Top Layer w0.8: K1.1 41.94,56.53 arc(41.86,56.15) 41.65,55.82 38.65,52.82 arc(38.32,52.6) 37.94,52.53 29.18,52.53 arc(28.8,52.45) 28.48,52.23 D13.2
RLM2: length 10.8
  Top Layer w0.8: K2.1 25.56,55.77 arc(25.48,55.38) 25.26,55.06 24.68,54.47 arc(24.35,54.25) 23.97,54.18 22.64,54.18 arc(22.26,54.1) 21.93,53.88 19.3,51.26 D14.2
RON: length 1.5
  Top Layer w0.254: 40.28,37.94 40.49,38.16 U5.5
RRES: length 2.1
  Top Layer w0.254: R20.1 1.98,14.5 LED1.3
RXD0EP: length 27.3
  Top Layer w0.254: U6.36 22.05,24.16 arc(21.67,24.24) 21.34,24.45 16.5,29.3 arc(16.17,29.51) 15.79,29.59 10.73,29.59 arc(10.34,29.67) 10.02,29.88 6.34,33.56 arc(6.01,33.78) 5.63,33.86 U17.3
SPI_CLK: length 9.9
  Top Layer w0.254: v1(30.45,22.48) 30.04,22.89 30,22.89 ; U6.35 30,22.89 ; 30,22.89 30,24.15 ; v1(33.73,21.72) 33.78,21.67 RN1.1
  Bottom Layer w0.254: v1(30.45,22.48) 30.71,22.22 33.22,22.22 v1(33.73,21.72)
SPI_CS: length 10.9
  Top Layer w0.254: 31.27,21.62 31.74,21.62 arc(32.12,21.54) 32.44,21.33 32.61,21.16 arc(32.93,20.95) 33.31,20.87 RN1.2 ; 31.27,21.62 U6.34 ; 31.27,21.62 31.27,24.15
SPI_MISO: length 10.6
  Top Layer w0.254: 30,19.08 34.37,19.08 RN1.4 ; 30,19.08 U7.6 ; 30,19.08 U6.32
SPI_MOSI: length 10.2
  Top Layer w0.254: v1(33.73,20.04) 34.53,20.04 RN1.3 ; 28.68,17.81 v1(29.24,18.36) ; 28.68,17.81 U6.31 ; 28.68,17.81 28.73,17.81 U7.5
  Bottom Layer w0.254: v1(33.73,20.04) 33.25,20.04 31.87,18.66 arc(31.54,18.44) 31.16,18.36 v1(29.24,18.36)
SS: length 4.8
  Top Layer w0.254: U5.6 41.27,37.5 arc(40.89,37.43) 40.57,37.21 39.6,36.25 arc(39.39,35.92) 39.31,35.54 C15.2
SW: length 2.3
  Top Layer w0.254: U3.4 45.08,19.04 arc(44.7,19.11) 44.37,19.33 44.01,19.69 43.45,19.69
TEMP: length 7.3
  Top Layer w0.254: U6.15 10.64,10.4 arc(10.72,10.01) 10.94,9.69 11.49,9.13 arc(11.82,8.92) 12.2,8.84 13.63,8.84 arc(14.01,8.76) 14.34,8.55 14.55,8.34 arc(14.76,8.01) 14.84,7.63 14.84,7.08
TXD0EP: length 27.8
  Top Layer w0.254: U17.2 4.44,36.4 arc(4.82,36.32) 5.14,36.11 10.65,30.59 arc(10.98,30.38) 11.36,30.3 16.07,30.3 arc(16.45,30.23) 16.78,30.01 21.06,25.72 arc(21.39,25.51) 21.77,25.43 U6.37
UVLO: length 10.3
  Top Layer w0.254: R15.2 43.42,34.89 ; 43.42,34.89 v2(43.42,36.02) ; 43.42,34.89 R13.1 ; v2(40.39,38.74) 40.45,38.8 U5.4
  Bottom Layer w0.254: v2(40.39,38.74) 40.39,37.92 42,36.31 arc(42.32,36.09) 42.7,36.02 v2(43.42,36.02)
VCA: length 4.8
  Top Layer w0.254: U5.10 49.55,38.16 49.91,37.8 51.9,37.8 C16.2
VS: length 4.9
  Top Layer w0.254: U3.12 48.38,20.98 49.68,22.28 50.32,22.28 50.81,22.76 arc(51.02,23.09) 51.1,23.47 C1.1
$1N4614: length 4.3
  Top Layer w0.254: R39.2 28.75,43.51 R40.1 28.13,42.89 Q5.4
$1N4985: length 4.2
  Top Layer w0.254: 18.24,41.06 18.24,42.82 Q6.4 19.66,43.02 R41.2

## Copper pours and planes (outline as drawn; the poured copper is in the pictures)
+3V3 on Top Layer: 18.92,33.88 23.8,33.88 23.8,31.19 18.92,31.19
+5V on Top Layer: 32.59,51.13 41.81,51.13 41.81,44.75 32.59,44.75
+48V on Top Layer: 32.16,41.78 42.65,41.78 42.65,35.64 32.16,35.64
+48V on Top Layer: 11.94,62.38 38.35,62.38 38.35,53.8 11.94,53.8
+48V on Top Layer: 46.64,24.46 48.18,24.46 48.18,21.18 46.64,21.18
+48V on Bottom Layer: 46.62,24.46 49.79,24.46 49.79,18.8 46.62,18.8
+48V on Bottom Layer: 34.29,59 45.95,59 45.95,38.26 34.29,38.26
+48V on Inner2: 43.38,53.62 53.8,53.62 53.8,21.13 43.38,21.13
GND on Top Layer: 18.92,36.79 23.82,36.79 23.82,34.09 18.92,34.09
GND on Top Layer: -12.45,94.49 67.94,94.49 67.94,-26.57 -12.45,-26.57
GND on Bottom Layer: -51.97,86.54 145.06,86.54 145.06,-53.44 -51.97,-53.44
GND on Inner1: -26.26,121.01 84.1,121.01 84.1,-52.32 -26.26,-52.32
GND on Inner2: -44.02,109.17 121.79,109.17 121.79,-48.01 -44.02,-48.01
VCC on Top Layer: 10.62,39.12 18.36,39.12 18.36,33.45 10.62,33.45
VIN on Top Layer: 8.25,67 52.2,67 52.2,53.16 8.25,53.16
VIN on Top Layer: 37.34,25.78 45.9,25.78 45.9,19.47 37.34,19.47
VIN on Bottom Layer: 37.36,57.73 52.2,57.73 52.2,21.92 37.36,21.92
PW_LEFT on Bottom Layer: 5.21,72.08 43.94,72.08 43.94,43.38 5.21,43.38
PW_RIGHT on Bottom Layer: 5.33,72.59 27.43,72.59 27.43,46.94 5.33,46.94
RLM on Top Layer: 21.72,52.02 28.32,52.02 28.32,44.27 21.72,44.27
RLM2 on Top Layer: 13.34,52.15 19.94,52.15 19.94,44.4 13.34,44.4
SW1 on Top Layer: 46.58,51.44 52.73,51.44 52.73,39.29 46.58,39.29
VS on Top Layer: 44.31,29.82 53.82,29.82 53.82,16.71 44.31,16.71

Small or netless copper shapes (teardrops, artwork), in the pictures only: 183 on Top Layer, 35 on Bottom Layer, 2 on Inner2
